# Altium schematic sheet display.SchDoc
size A4; SheetNumber: 5; SheetTotal: 7
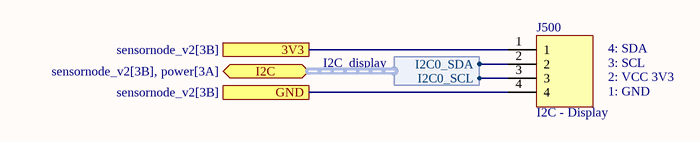
[diagram p0: display.SchDoc]

## Parts
J500  I2C - Display  [HEADER_4_RM_2.54]

## Ports
3V3 (see sensornode_v2[3B]), GND (see sensornode_v2[3B]), I2C (bidir, harness I2C_display, see sensornode_v2[3B], power[3A])

## Harnesses
I2C_display: I2C0_SDA, I2C0_SCL

## Nets
3V3: J500.1 ; port 3V3
GND: J500.4 ; port GND
NetJ500_2: J500.2 ; port I2C.I2C0_SDA
NetJ500_3: J500.3 ; port I2C.I2C0_SCL

## Notes on the sheet
- 4: SDA
- 1: GND
- 2: VCC 3V3
- 3: SCL

## Library data of the parts
J500 = CON4